# EAGLE design I2C_teplomer (EAGLE 5.06)

## Sheet 1 of 3
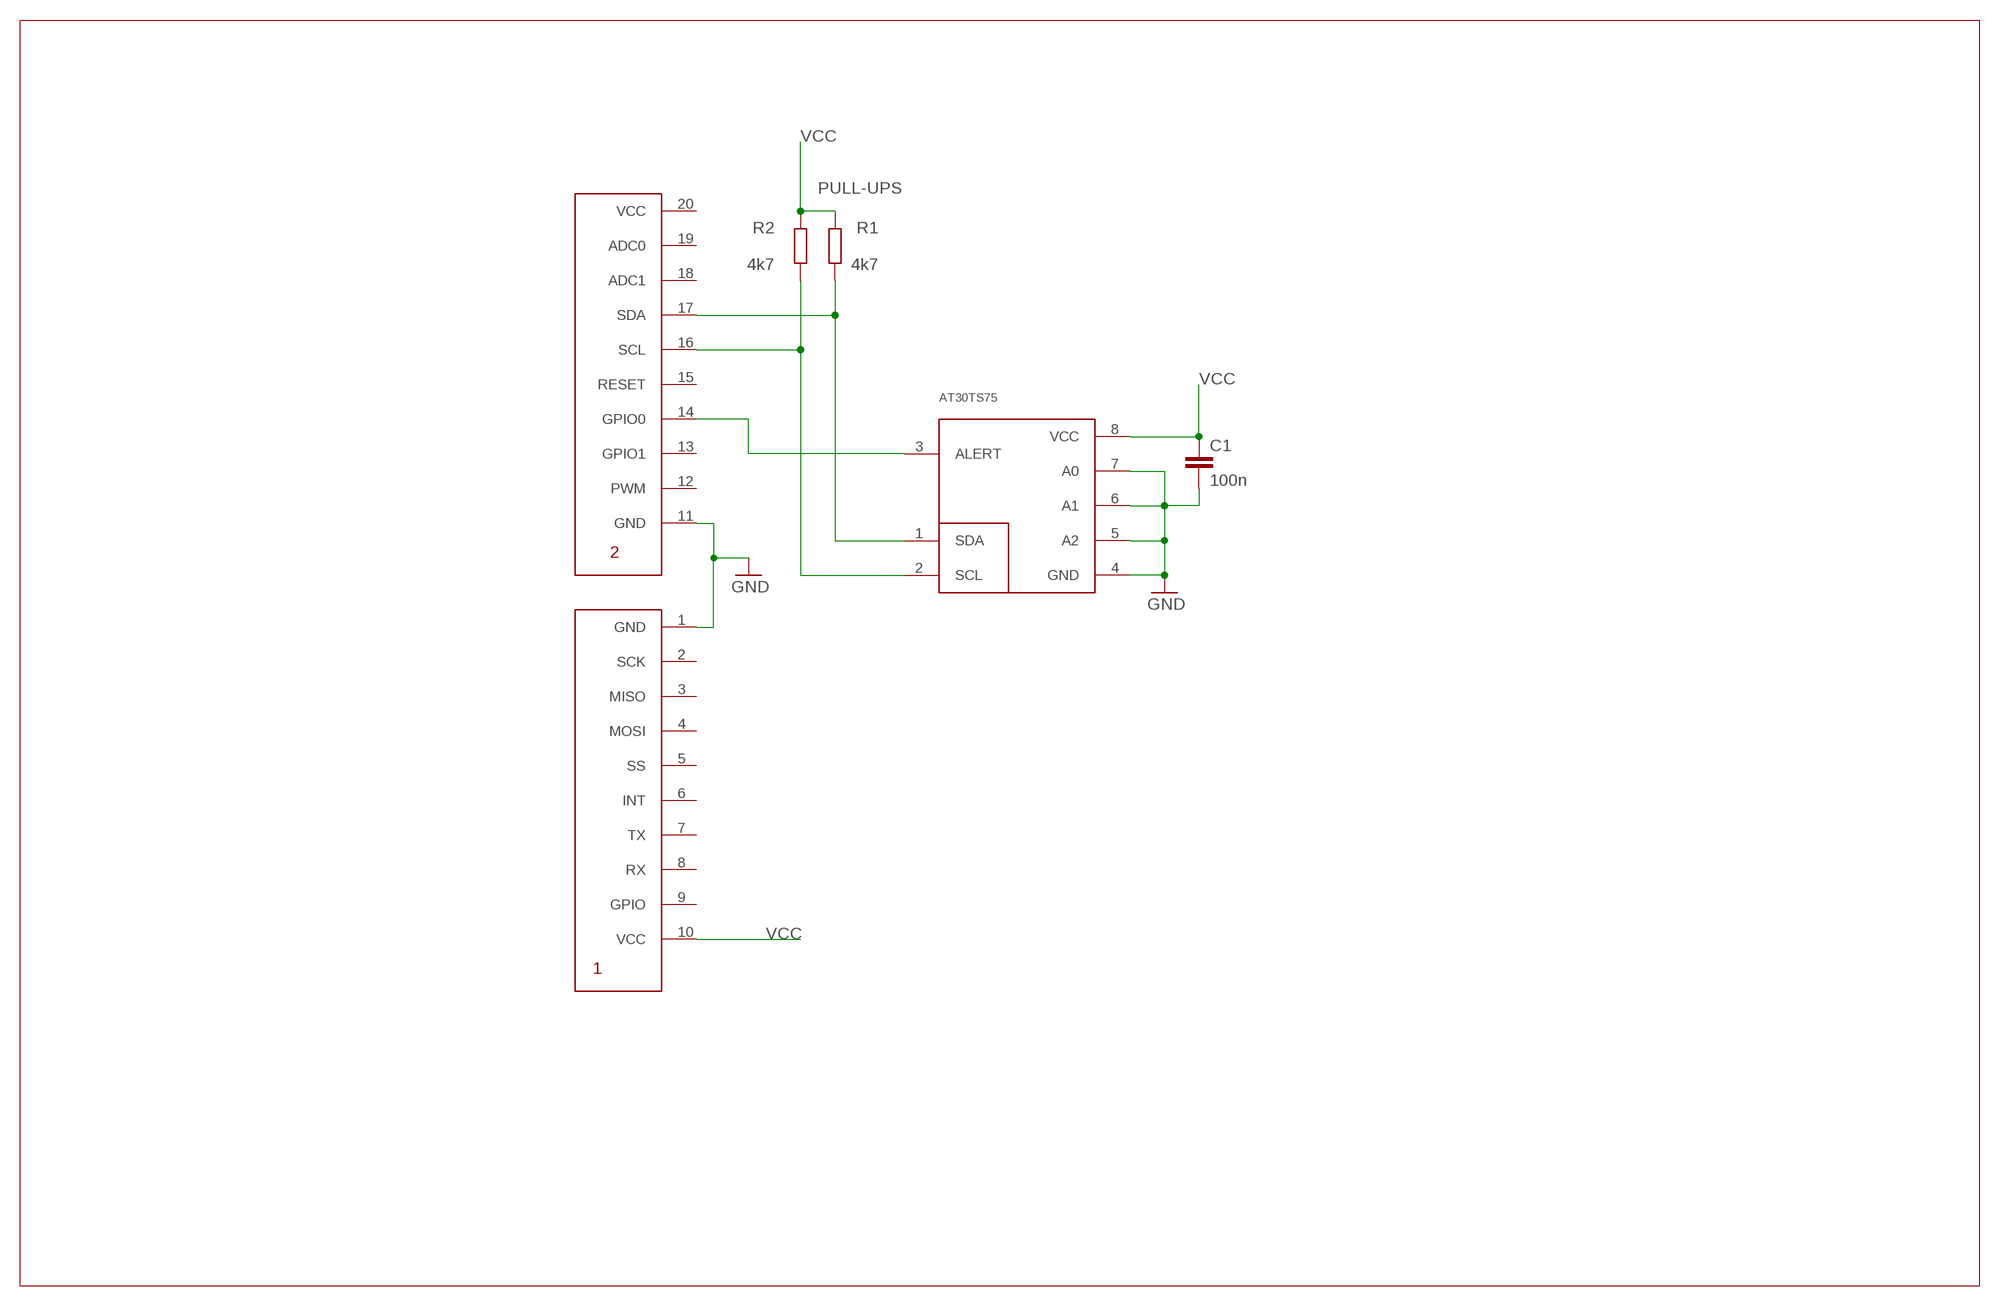
[diagram p0: schematic, sheet 1]

### Parts
C1  100n  C-EUC1206  [C1206]
MM1  MMSYS_CONECTOR  [MMSYSTEMS_CON]
R1  4k7  R-EU_M1206  [M1206]
R2  4k7  R-EU_M1206  [M1206]
U$1  ATMEL_TEMP_SENSOR_AT30TS75  [SOIC8]

### Nets
GND: C1.2 MM1.1(GND) MM1.11(GND) U$1.4(GND) U$1.5(A2) U$1.6(A1) U$1.7(A0)
N$1: MM1.17(SDA) R1.1 U$1.1(SDA)
N$2: MM1.16(SCL) R2.1 U$1.2(SCL)
N$3: MM1.14(GPIO0) U$1.3(ALERT)
VCC: C1.1 MM1.10(VCC) R1.2 R2.2 U$1.8(VCC)
Unconnected: MM1.2(SCK) MM1.3(MISO) MM1.4(MOSI) MM1.5(SS) MM1.6(INT) MM1.7(TX) MM1.8(RX) MM1.9(GPIO) MM1.12(PWM) MM1.13(GPIO1) MM1.15(RESET) MM1.18(ADC1) MM1.19(ADC0) MM1.20(VCC)

### Notes on the sheet
- PULL-UPS

## Sheet 2 of 3
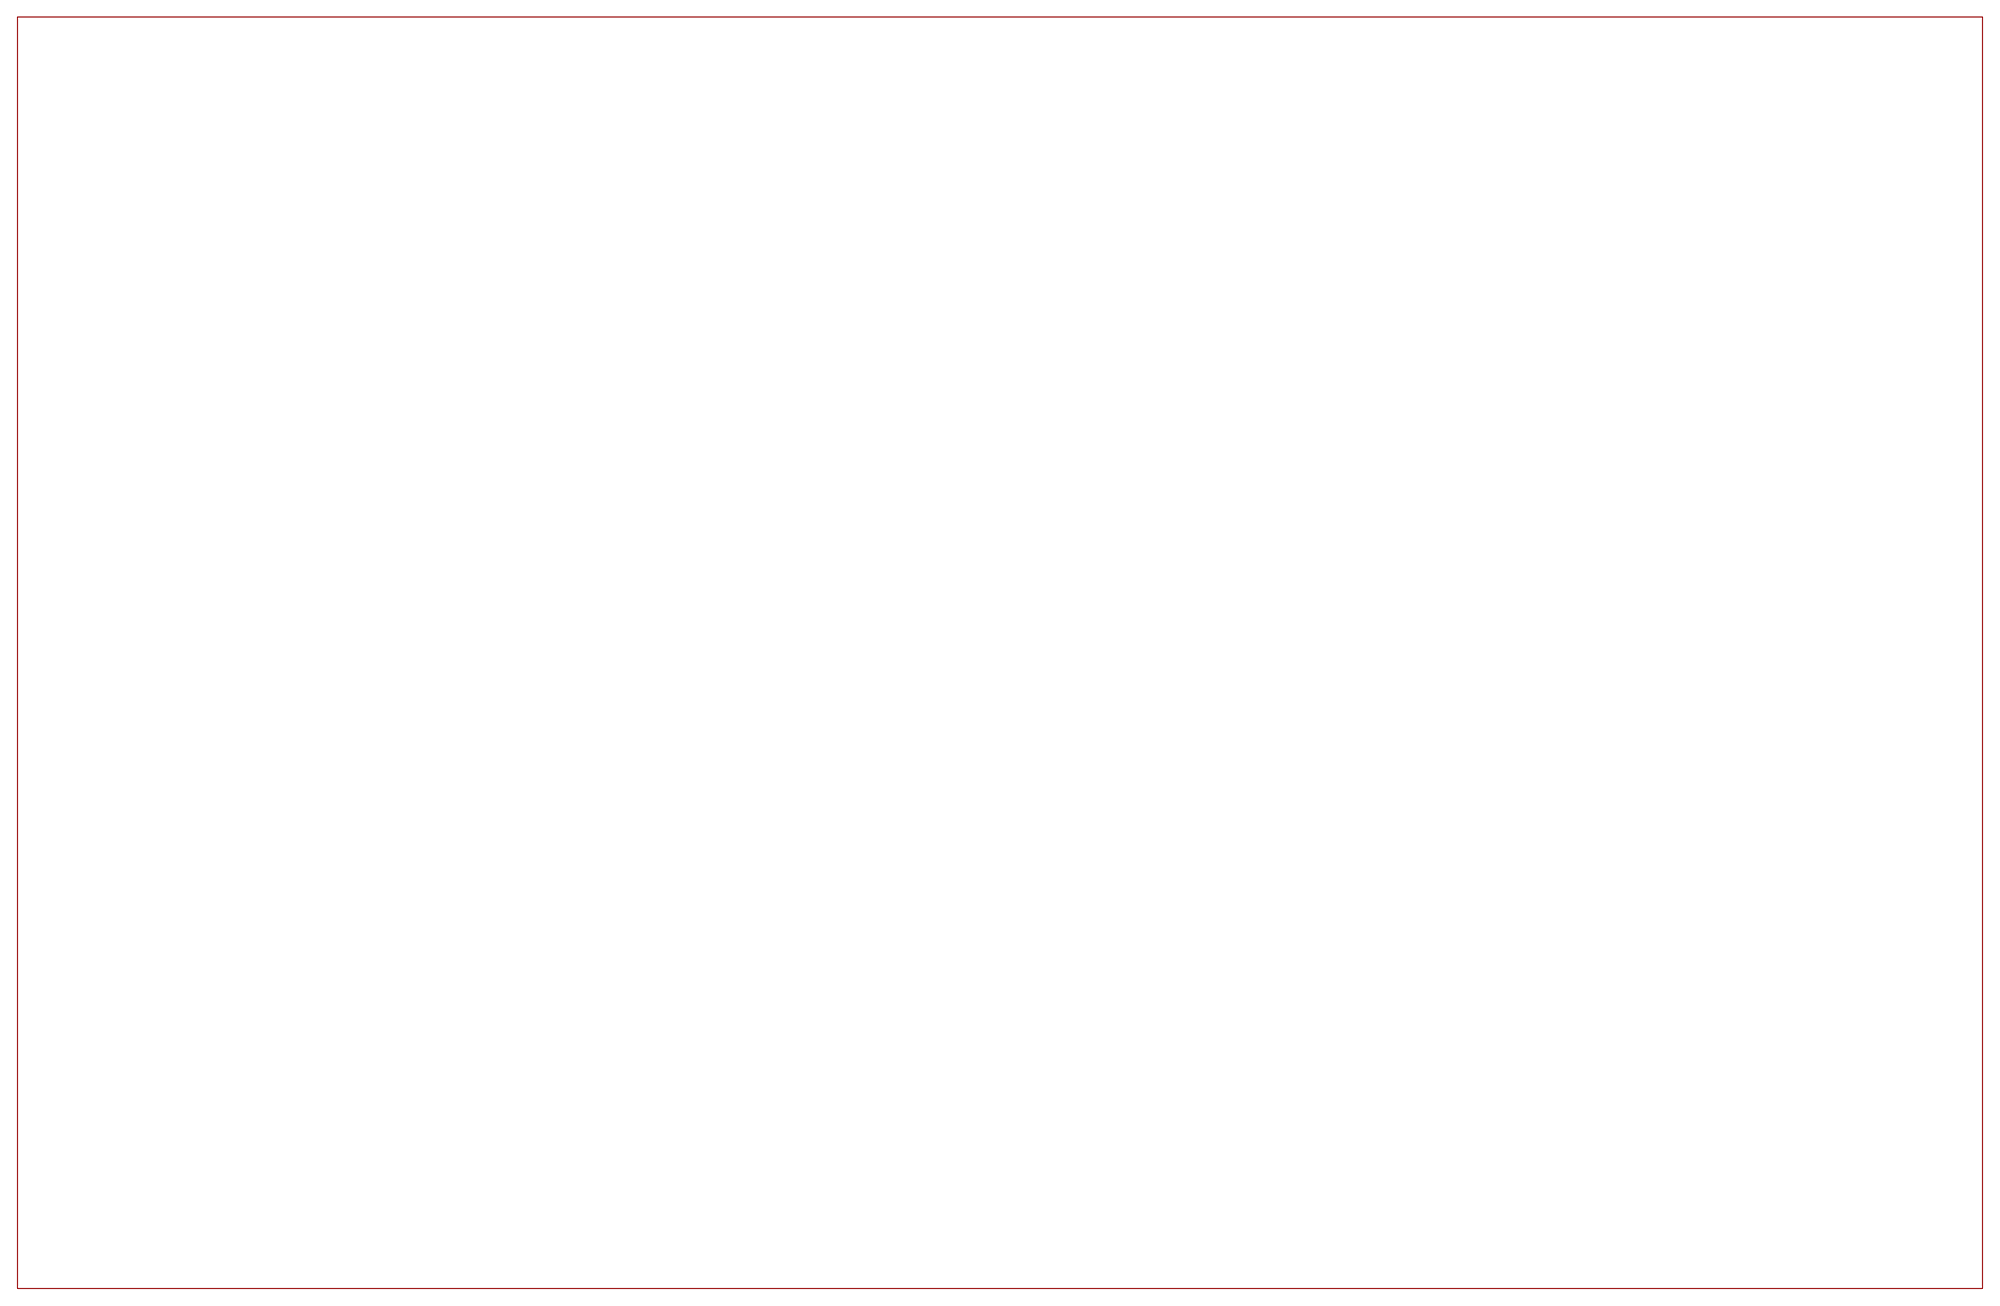
[diagram p1: schematic, sheet 2]

## Sheet 3 of 3
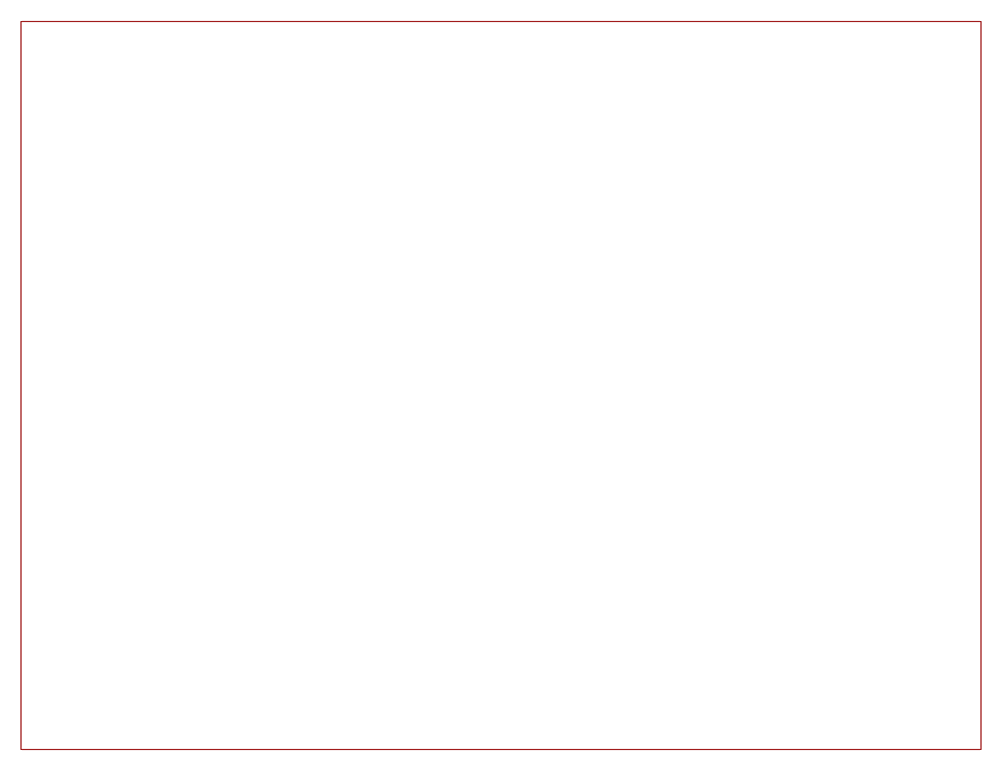
[diagram p2: schematic, sheet 3]

## Library data of the parts
C1 = resistor:C-EU: CAPACITOR, European symbol
MM1 = atmega16u4:MMSYS_CONECTOR
R1 R2 = resistor:R-EU_: RESISTOR, European symbol
U$1 = AT30TS75:ATMEL_TEMP_SENSOR_AT30TS75: Temperature sensor I2C

## Board
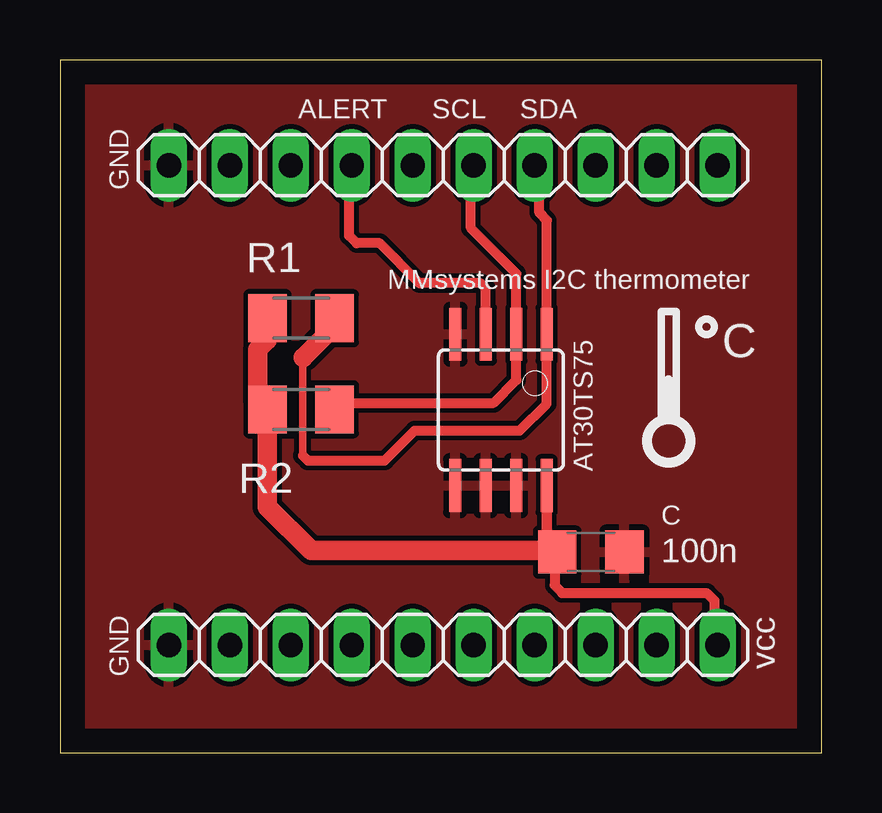
[diagram p3: board, top side]

Size 31.73 x 28.88 mm. Coordinates in mm from the lower left corner, seen from the top.
Outline: 0,0 0.03,0
Outline: 0.03,0 31.73,0 31.73,28.88 0,28.88
Outline: 0.03,0 0.03,28.88
Copper layers (1*16): Top 0.035mm / dielectric 1.5mm / Bottom 0.035mm
Design rules "default": minimum track width 10mil, minimum drill 24mil, track to track 8mil, track to pad 8mil, pad to pad 8mil, via to via 8mil, smd to smd 8mil, copper to edge 40mil, drill to drill 8mil, minimum pad ring 10mil, minimum via ring 8mil, stop-mask expansion 4mil, vias tented up to drill 0mil, thermal gap 10mil

### Footprints (pad centres in the part's own frame; a part is rotated, then mirrored left to right if it is on the bottom)
C1206 = smd 1.6 x 1.8: 1 -1.4,0; 2 1.4,0
MMSYSTEMS_CON = drill 1.016 long: 1 2,1; 2 4.54,1; 3 7.08,1; 4 9.62,1; 5 12.16,1; 6 14.7,1; 7 17.24,1; 8 19.78,1; 9 22.32,1; 10 24.86,1; 11 2,21; 12 4.54,21; 13 7.08,21; 14 9.62,21; 15 12.16,21; 16 14.7,21; 17 17.24,21; 18 19.78,21; 19 22.32,21; 20 24.86,21
M1206 = smd 1.6 x 2: 1 -1.4,0; 2 1.4,0
SOIC8 = smd 0.5 x 2.2: 1 -1.905,-3.154; 2 -0.645,-3.154; 3 0.625,-3.154; 4 1.895,-3.154; 5 1.905,3.154; 6 0.635,3.154; 7 -0.635,3.154; 8 -1.905,3.154

### Placement (x,y rotation side)
C1  22.12,8.36 0 top
MM1  2.54,3.49 0 top
R1  10.04,18.12 180 top
R2  10.04,14.31 180 top
U$1  18.37,14.29 180 top

### Tracks (layer width: path | path; a pad name or v marks a point on that pad's centre or on a via)
GND
  pour Top: -1.9,29.8 33.6,29.8 33.6,-1.58 -1.9,-1.58
N$1
  Top 0.305: 10.12,12.38 10.12,16.45 10.14,16.48
  Top 0.406: 10.12,12.38 10.32,12.17 13.53,12.17 14.78,13.42 19.16,13.42 20.27,14.54 U$1.1 20.29,17.46 20.29,22.19 19.97,22.51 19.97,24.29 MM1.17
  Top 0.813: R1.1 11.45,17.79 10.14,16.48
N$2
  Top 0.406: R2.1 11.72,14.58 18.07,14.58 19.02,15.53 19.02,15.54 U$1.2 19.02,19.97 17.12,21.87 17.12,24.37 MM1.16
N$3
  Top 0.406: U$1.3 17.73,17.45 17.73,19.37 17.53,19.57 14.98,19.57 13.31,21.24 12.36,21.24 12.05,21.56 12.05,24.38 MM1.14
VCC
  Top 0.406: 20.41,8.42 20.27,8.55 U$1.8 20.27,8.67 C1.1 20.61,8.25 20.61,6.97 20.92,6.66 26.95,6.66 27.26,6.34 27.26,4.62 MM1.10
  Top 0.813: 20.41,8.42 10.46,8.42 8.64,10.24 R2.2 8.24,14.71 8.24,16.8 8.64,17.2 R1.2

### Text on the board
tNames: ALERT | SCL | SDA | GND | MMsystems I2C thermometer | C | AT30TS75 | C | 100n | GND | vcc